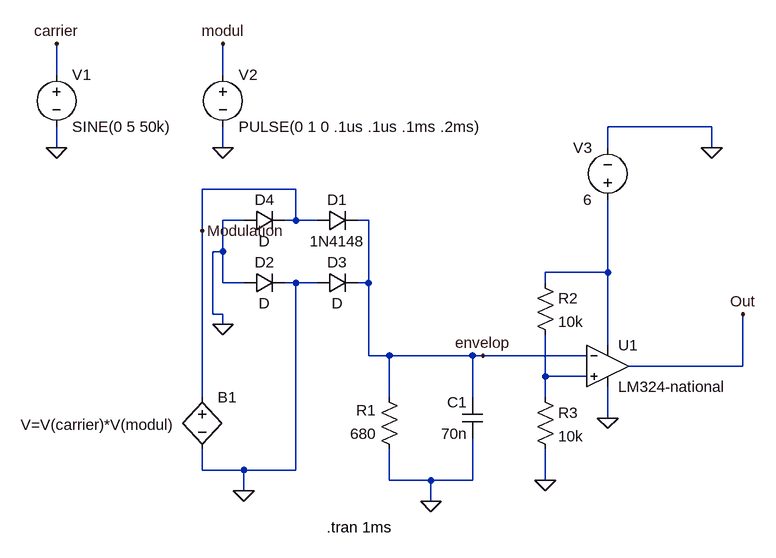
[diagram p0: schematic Demodulation-ASK-2.asc]
Demodulation-ASK-2.asc, the LTspice schematic file:
Version 4
SHEET 1 1048 680
WIRE -128 -448 -128 -496
WIRE 128 -448 128 -496
WIRE 880 -368 720 -368
WIRE -128 -336 -128 -368
WIRE 128 -336 128 -368
WIRE 720 -336 720 -368
WIRE 880 -336 880 -368
WIRE 240 -272 96 -272
WIRE 160 -224 128 -224
WIRE 240 -224 240 -272
WIRE 240 -224 224 -224
WIRE 272 -224 240 -224
WIRE 352 -224 336 -224
WIRE 96 -208 96 -272
WIRE 128 -176 128 -224
WIRE 128 -176 112 -176
WIRE 720 -144 720 -256
WIRE 720 -144 624 -144
WIRE 128 -128 128 -176
WIRE 160 -128 128 -128
WIRE 240 -128 224 -128
WIRE 272 -128 240 -128
WIRE 352 -128 352 -224
WIRE 352 -128 336 -128
WIRE 624 -128 624 -144
WIRE 112 -80 112 -176
WIRE 128 -80 112 -80
WIRE 128 -64 128 -80
WIRE 720 -32 720 -144
WIRE 352 -16 352 -128
WIRE 384 -16 352 -16
WIRE 512 -16 384 -16
WIRE 528 -16 512 -16
WIRE 688 -16 528 -16
WIRE 928 0 928 -80
WIRE 928 0 752 0
WIRE 624 16 624 -48
WIRE 688 16 624 16
WIRE 96 48 96 -208
WIRE 384 48 384 -16
WIRE 512 48 512 -16
WIRE 624 48 624 16
WIRE 720 80 720 32
WIRE 96 160 96 128
WIRE 160 160 96 160
WIRE 240 160 240 -128
WIRE 240 160 160 160
WIRE 384 176 384 128
WIRE 448 176 384 176
WIRE 512 176 512 112
WIRE 512 176 448 176
WIRE 624 176 624 128
WIRE 160 192 160 160
WIRE 448 208 448 176
FLAG 128 -336 0
FLAG -128 -336 0
FLAG 128 -496 modul
FLAG -128 -496 carrier
FLAG 528 -16 envelop
FLAG 720 80 0
FLAG 928 -80 Out
FLAG 624 176 0
FLAG 880 -336 0
FLAG 96 -208 Modulation
FLAG 128 -64 0
FLAG 448 208 0
FLAG 160 192 0
DATAFLAG 96 48 "$"
SYMBOL bv 96 32 R0
WINDOW 3 -279 58 Left 2
SYMATTR Value V=V(carrier)*V(modul)
SYMATTR InstName B1
SYMBOL voltage 128 -464 R0
WINDOW 123 0 0 Left 0
WINDOW 39 0 0 Left 0
SYMATTR InstName V2
SYMATTR Value PULSE(0 1 0 .1us .1us .1ms .2ms)
SYMBOL voltage -128 -464 R0
SYMATTR InstName V1
SYMATTR Value SINE(0 5 50k)
SYMBOL cap 528 112 R180
WINDOW 0 24 56 Left 2
WINDOW 3 24 8 Left 2
SYMATTR InstName C1
SYMATTR Value 70n
SYMBOL res 400 144 R180
WINDOW 0 36 76 Left 2
WINDOW 3 36 40 Left 2
SYMATTR InstName R1
SYMATTR Value 680
SYMBOL diode 272 -208 R270
WINDOW 0 32 32 VTop 2
WINDOW 3 0 32 VBottom 2
SYMATTR InstName D1
SYMATTR Value 1N4148
SYMBOL voltage 720 -240 R180
WINDOW 0 24 96 Left 2
WINDOW 3 24 16 Left 2
SYMATTR InstName V3
SYMATTR Value 6
SYMBOL res 608 -144 R0
SYMATTR InstName R2
SYMATTR Value 10k
SYMBOL res 608 32 R0
SYMATTR InstName R3
SYMATTR Value 10k
SYMBOL Opamps/LM324-national 720 -64 R0
SYMATTR InstName U1
SYMBOL diode 160 -112 R270
WINDOW 0 32 32 VTop 2
WINDOW 3 0 32 VBottom 2
SYMATTR InstName D2
SYMBOL diode 272 -112 R270
WINDOW 0 32 32 VTop 2
WINDOW 3 0 32 VBottom 2
SYMATTR InstName D3
SYMBOL diode 160 -208 R270
WINDOW 0 32 32 VTop 2
WINDOW 3 0 32 VBottom 2
SYMATTR InstName D4
TEXT 288 248 Left 2 !.tran 1ms

The netlist it stands for:
* Demodulation-ASK-2.asc
B1 Modulation 0 V=V(carrier)*V(modul)
V2 modul 0 PULSE(0 1 0 .1us .1us .1ms .2ms)
V1 carrier 0 SINE(0 5 50k)
C1 0 envelop 70n
R1 0 envelop 680
D1 Modulation envelop 1N4148
V3 N001 0 6
R2 N001 N002 10k
R3 N002 0 10k
XU1 N002 envelop N001 0 Out LM324-national  ; pins In+ In- V+ V- OUT
D2 0 0 D
D3 0 envelop D
D4 0 Modulation D
.model D D
.lib standard.dio
.tran 1ms
.backanno
.end

* Results of the author's LTspice run, read from the files saved beside the schematic
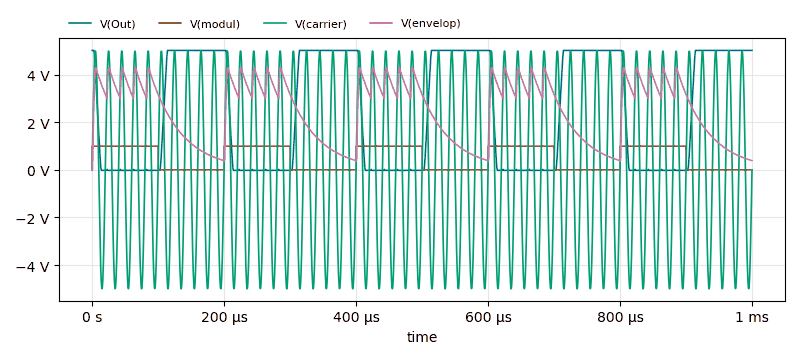
[diagram p1: Transient Analysis of Demodulation-ASK-2.asc, plotted from the saved traces]
* Transient Analysis, 1 run:
*   V(Out): min -21.07 mV, max 5.026 V, average 2.492 V, rms 3.482 V, last 5.025 V
*   V(modul): min 0 V, max 1 V, average 500.5 mV, rms 707.4 mV, last 0 V
*   V(carrier): min -5 V, max 5 V, average 2.912 mV, rms 3.545 V, last 0 V
*   V(envelop): min 2.086 mV, max 4.3 V, average 2.465 V, rms 2.799 V, last 389.9 mV